# Altium schematic sheet MCUPOWER.SchDoc
size A3
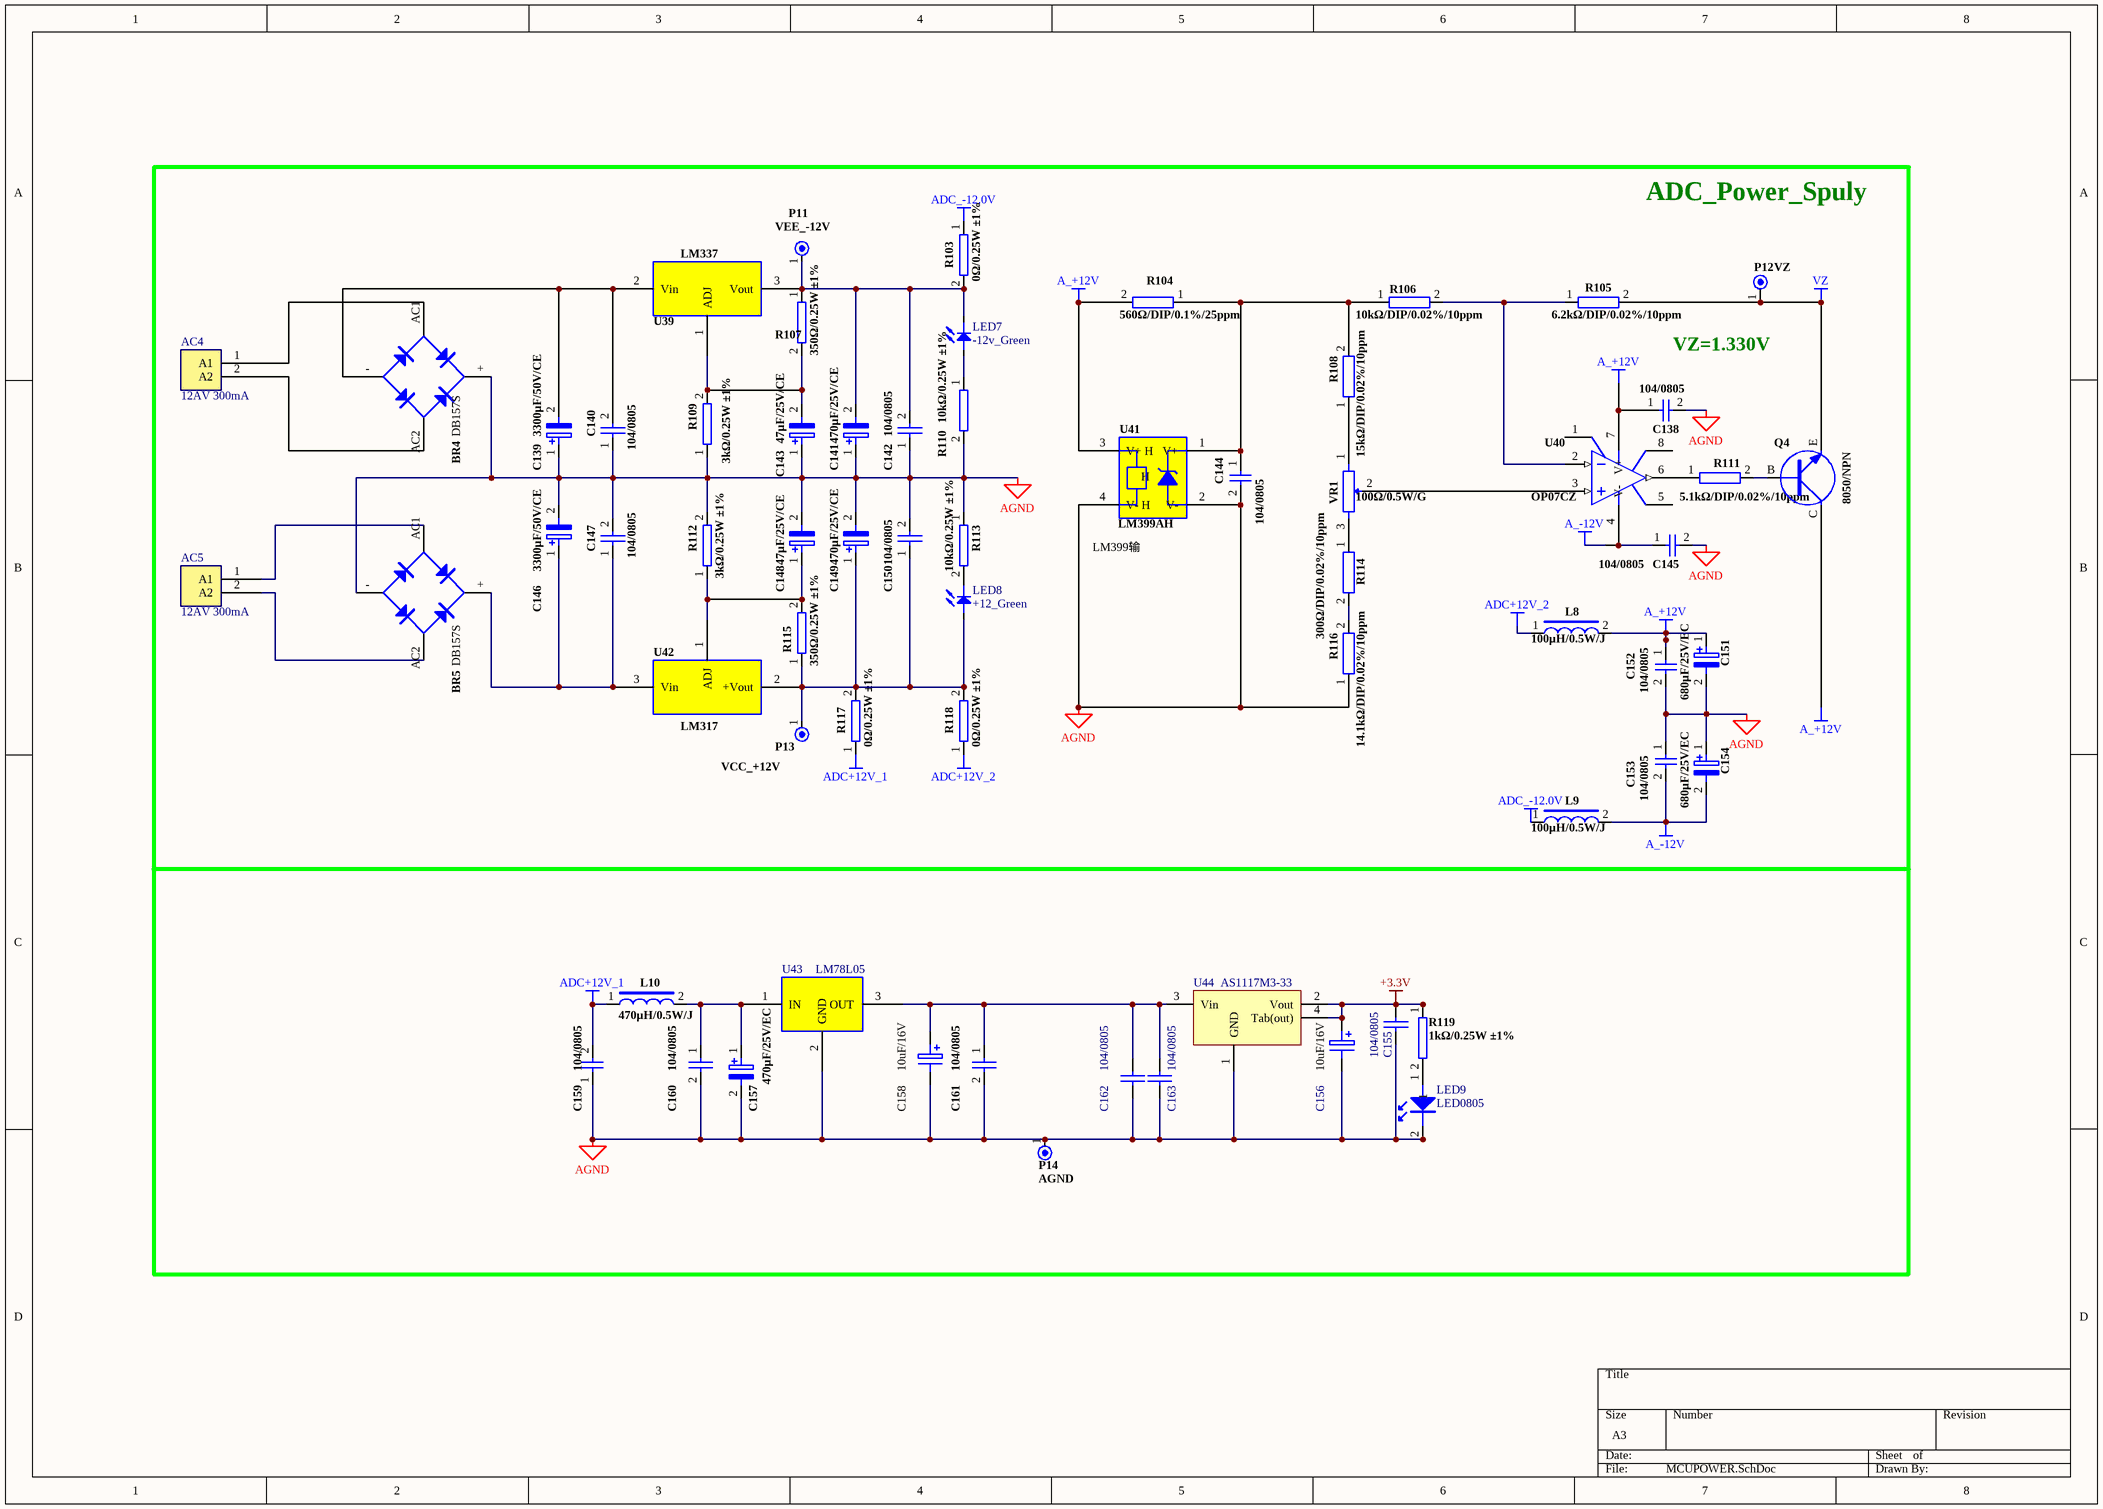
[diagram p0: MCUPOWER.SchDoc]

## Parts
AC4  12AV 300mA  [HEADER2]
AC5  12AV 300mA  [HEADER2]
BR4  DB157S  [DB157S]
BR5  DB157S  [DB157S]
C138  104/0805  [C0805]
C139  3300μF/50V/CE  [RB.3/.6]
C140  104/0805  [C0805]
C141  470μF/25V/CE  [RB.2/.4]
C142  104/0805  [C0805]
C143  47μF/25V/CE  [RB.1/.2]
C144  104/0805  [C0805]
C145  104/0805  [C0805]
C146  3300μF/50V/CE  [RB.3/.6]
C147  104/0805  [C0805]
C148  47μF/25V/CE  [RB.1/.2]
C149  470μF/25V/CE  [RB.2/.4]
C150  104/0805  [C0805]
C151  680μF/25V/EC  [RB.2/.4]
C152  104/0805  [C0805]
C153  104/0805  [C0805]
C154  680μF/25V/EC  [RB.2/.4]
C155  104/0805  [C0805]
C156  10uF/16V  [C3216]
C157  470μF/25V/EC  [RB.2/.4]
C158  10uF/16V  [C3216]
C159  104/0805  [C0805]
C160  104/0805  [C0805]
C161  104/0805  [C0805]
C162  104/0805  [C0805]
C163  104/0805  [C0805]
L8  100μH/0.5W/J  [AXIAL0.4]
L9  100μH/0.5W/J  [AXIAL0.4]
L10  470μH/0.5W/J  [AXIAL0.4]
LED7  -12v_Green  [LED_0805]
LED8  +12_Green  [LED_0805]
LED9  LED0805  [LED_0805]
P11  VEE_-12V  [TESTSMD]
P12  VZ  [TESTSMD]
P13  VCC_+12V  [TESTSMD]
P14  AGND  [TESTSMD]
Q4  8050/NPN  [TO92A]
R103  0Ω/0.25W ±1%  [R0805]
R104  560Ω/DIP/0.1%/25ppm  [AXIAL-0.6-R]
R105  6.2kΩ/DIP/0.02%/10ppm  [AXIAL-0.6-R]
R106  10kΩ/DIP/0.02%/10ppm  [AXIAL-0.6-R]
R107  350Ω/0.25W ±1%  [R0805]
R108  15kΩ/DIP/0.02%/10ppm  [AXIAL-0.6-R]
R109  3kΩ/0.25W ±1%  [R0805]
R110  10kΩ/0.25W ±1%  [R0805]
R111  5.1kΩ/DIP/0.02%/10ppm  [AXIAL-0.6-R]
R112  3kΩ/0.25W ±1%  [R0805]
R113  10kΩ/0.25W ±1%  [R0805]
R114  300Ω/DIP/0.02%/10ppm  [AXIAL-0.6-R]
R115  350Ω/0.25W ±1%  [R0805]
R116  14.1kΩ/DIP/0.02%/10ppm  [AXIAL-0.6-R]
R117  0Ω/0.25W ±1%  [R0805]
R118  0Ω/0.25W ±1%  [R0805]
R119  1kΩ/0.25W ±1%  [R0805]
U39  LM337  [TO220H]
U40  OP07CZ  [SO-8]
U41  LM399AH  [LM399]
U42  LM317  [TO220H]
U43  LM78L05  [TO-220]
U44  AS1117M3-33  [SOT-223-3L(M3)]
VR1  100Ω/0.5W/G  [3224W]

## Nets
+3.3V: C155.1 C156.1 R119.1 U44.2(Vout) U44.4(Tab(out))
A_+12V: C138.1 C151.1 C152.1 L8.2 Q4.C R104.2 U40.7(V+) U41.3(V+_H)
A_-12V: C145.1 C153.2 C154.2 L9.2 U40.4(V-)
ADC+12V_1: C159.2 L10.1 R117.1
ADC+12V_2: L8.1 R118.1
ADC_-12.0V: L9.1 R103.1
AGND: BR4.+(V+) BR5.-(V-) C138.2 C139.1 C140.1 C141.1 C142.1 C143.1 C144.2 C145.2 C146.2 C147.2 C148.2 C149.2 C150.2 C151.2 C152.2 C153.1 C154.1 C155.2 C156.2 C157.2 C158.2 C159.1 C160.2 C161.2 C162.2 C163.2 LED9.2 P14.1 R109.1 R110.2 R112.2 R113.1 R116.1 U41.2(V-) U41.4(V-_H) U43.2(GND) U44.1(GND)
VZ: P12.1 Q4.E R105.2
NetAC4_1: AC4.1(A1) BR4.AC1
NetAC4_2: AC4.2(A2) BR4.AC2
NetAC5_1: AC5.1(A1) BR5.AC1
NetAC5_2: AC5.2(A2) BR5.AC2
NetBR4_-: BR4.-(V-) C139.2 C140.2 U39.2(Vin)
NetBR5_+: BR5.+(V+) C146.1 C147.1 U42.3(Vin)
NetC141_2: C141.2 C142.2 LED7.2 P11.1 R103.2 R107.1 U39.3(Vout)
NetC143_2: C143.2 R107.2 R109.2 U39.1(ADJ)
NetC144_1: C144.1 R104.1 R106.1 R108.2 U41.1(V+)
NetC148_1: C148.1 R112.1 R115.2 U42.1(ADJ)
NetC149_1: C149.1 C150.1 LED8.1 P13.1 R115.1 R117.2 R118.2 U42.2(+Vout)
NetC157_1: C157.1 C160.1 L10.2 U43.1(IN)
NetC158_1: C158.1 C161.1 C162.1 C163.1 U43.3(OUT) U44.3(Vin)
NetLED7_1: LED7.1 R110.1
NetLED8_2: LED8.2 R113.2
NetLED9_1: LED9.1 R119.2
NetQ4_B: Q4.B R111.2
NetR105_1: R105.1 R106.2 U40.2
NetR108_1: R108.1 VR1.1
NetR111_1: R111.1 U40.6
NetR114_1: R114.1 VR1.3
NetR114_2: R114.2 R116.2
NetU40_3: U40.3 VR1.2

Not connected (* = marked no-connect by the designer): U40 1 5 8

## Notes on the sheet
- ADC_Power_Spuly
- VZ=1.330V
- (near U41) LM399输
- (in symbol LM399AH) H

## Library data of the parts
AC4 AC5 = CON2: 接线端子 AWG14-22 300VA 16A 5.0mm HEADER2
BR4 BR5 = NBRIDGE1: 贴片整流桥 DB157S 50A/1000V
C138 C140 C142 C144 C145 C147 C150 C152 C153 C155 C159-C163 = CAP: 贴片电容 104/25V ±1% C0805
  C162 C163: value: *
C139 C146 = ELECTRO2: 电解电容 3300μF/50V/CE ±10% RB.3/.6
C141 C149 = ELECTRO2: 电解电容 470μF/25V/CE ±10% RB.2/.4
C143 C148 = ELECTRO2: 电解电容 47μF/25V/CE ±10% RB.1/.2
C151 C154 = ELECTRO2: 电解电容 680μF/25V/EC ±10% RB.2/.4
C156 = ELECTRO1: 贴片钽电容 10uF/16V ±10% C3216
C157 = ELECTRO2: 电解电容 470μF/25V/EC ±10% RB.2/.4
C158 = ELECTRO1: 贴片钽电容 10uF/16V ±1% C3216
L8 L9 = INDUCTOR2: 直插电感 100μH/0.5W ±5% AXIAL0.4
L10 = INDUCTOR2: 直插电感 470μH/0.5W ±5% AXIAL0.4
LED7 LED8 = B_LED: 贴片LED灯 绿色 2.0V 20mA LED_0805
LED9 = LED0805: 贴片LED灯 蓝色 2.0V 20mA LED_0805
P11-P14 = CON1: 测试点
Q4 = NPN: 三极管 8050/NPN TO92A
R103 R117 R118 = RES2: 贴片电阻 0Ω 0.25W ±1% R0805
R104 = RES2: 高精度电阻 560Ω DIP 1W ±0.1% 25ppm AXIAL-0.6-R
R105 = RES3: 高精度电阻 6.2kΩ DIP 1W ±0.02% 10ppm AXIAL-0.6-R
R106 = RES3: 高精度电阻 10kΩ DIP 1W ±0.02% 10ppm AXIAL-0.6-R
R107 R115 = RES2: 贴片电阻 350Ω 0.25W ±1% R0805
R108 = RES3: 高精度电阻 15kΩ DIP 1W ±0.02% 10ppm AXIAL-0.6-R
R109 R112 = RES2: 贴片电阻 3kΩ 0.25W ±1% R0805
R110 R113 = RES2: 贴片电阻 10kΩ 0.25W ±1% R0805
R111 = RES2: 高精度电阻 5.1kΩ DIP 1W ±0.02% 10ppm AXIAL-0.6-R
R114 = RES2: 高精度电阻 300Ω DIP 1W ±0.02% 10ppm AXIAL-0.6-R
R116 = RES3: 高精度电阻 14.1kΩ DIP 1W ±0.02% 10ppm AXIAL-0.6-R
R119 = RES2: 贴片电阻 1kΩ 0.25W ±1% R0805; Part Field 1: 06-115611-18
U39 = LM337: 线性可调稳压IC LM337 TO220H
U40 = OP07CZ: 运算放大器 OP07CZ SO-8
U41 = LM399AH: 高精度电压比较器 LM399AH TO46-4
U42 = LM317: 线性可调稳压IC LM317 TO220H
U43 = LM78L05: 线性稳压芯片 LM78L05 TO-220
U44 = AS1117M3-33: 线性稳压管 AS1117M3-33 SOT-223; 物?: *; 部?: *; 供?: *
VR1 = RPOT: 高精密可调电位器 100Ω 0.5W/G 3224W